# EAGLE design node (EAGLE 7.3.0)
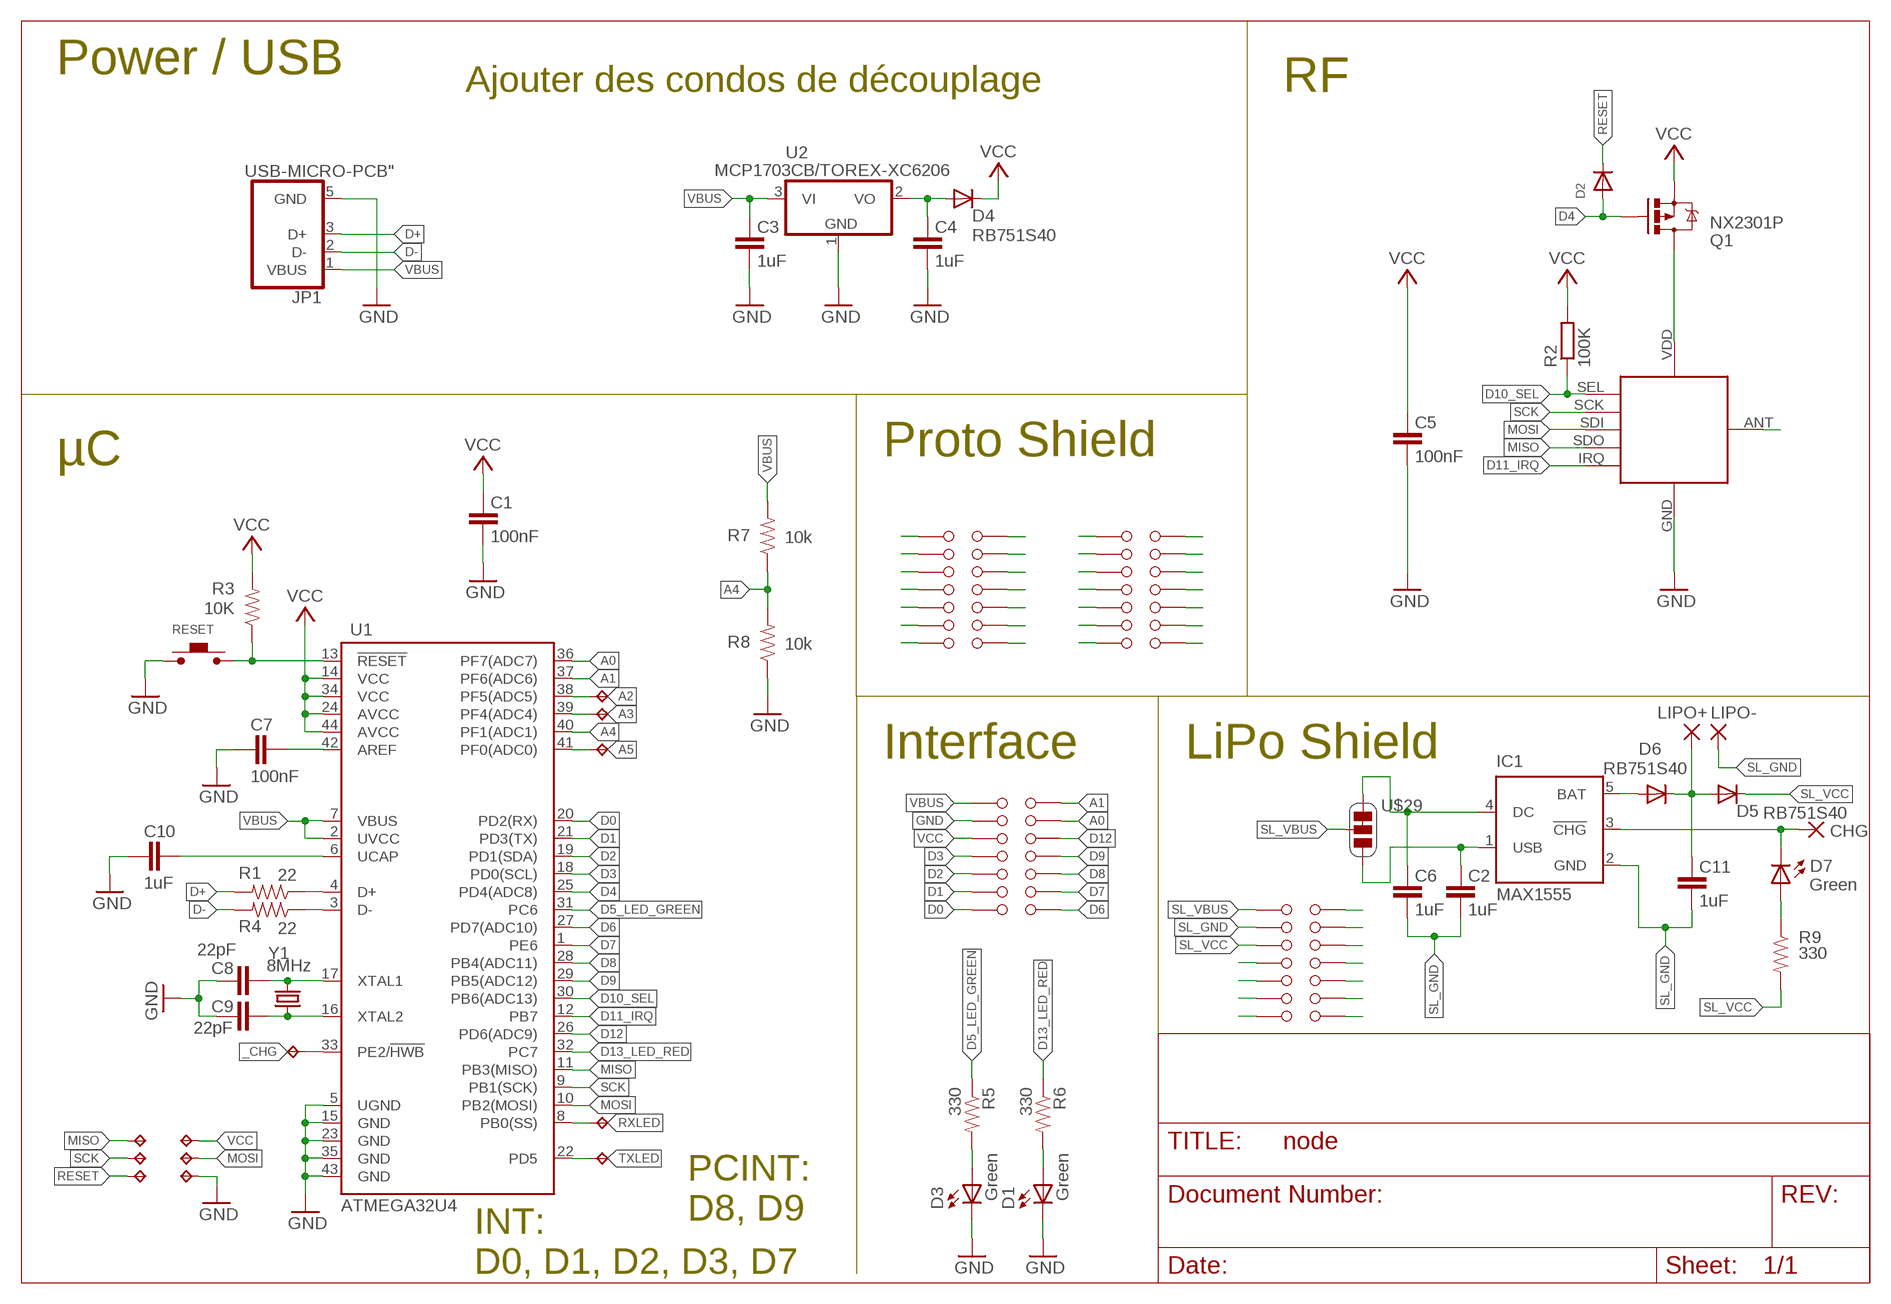
[diagram p0: schematic, sheet 1]

## Parts
C1  100nF  CAP0402-CAP  [0402-CAP]
C2  1uF  CAP0402-CAP  [0402-CAP]
C3  1uF  CAP0402-CAP  [0402-CAP]
C4  1uF  CAP0402-CAP  [0402-CAP]
C5  100nF  CAP0402-CAP  [0402-CAP]
C6  1uF  CAP0402-CAP  [0402-CAP]
C7  100nF  CAP0402-CAP  [0402-CAP]
C8  22pF  CAP0402-CAP  [0402-CAP]
C9  22pF  CAP0402-CAP  [0402-CAP]
C10  1uF  CAP0402-CAP  [0402-CAP]
C11  1uF  CAP0402-CAP  [0402-CAP]
CHG  WIREPAD1,6/0,8  [1,6/0,8]
D1  Green  LED0603  [LED-0603]
D2  DIODESOD-323F  [SOD-323F]
D3  Green  LED0603  [LED-0603]
D4  RB751S40  DIODE-SOD523  [SOD523]
D5  RB751S40  DIODE-SOD523  [SOD523]
D6  RB751S40  DIODE-SOD523  [SOD523]
D7  Green  LED0603  [LED-0603]
IC1  MAX1555  [SOT23-5L]
JP1  USB-MICRO-PCB"  [USB-MICRO-PCB]
LIPO+  WIREPAD1,6/0,8  [1,6/0,8]
LIPO-  WIREPAD1,6/0,8  [1,6/0,8]
Q1  NX2301P  MOSFET-PCHANNEL  [SOT23]
R1  22  RESISTOR0402-RES  [0402-RES]
R2  100K  R-EU_R0402  [R0402]
R3  10K  RESISTOR0402-RES  [0402-RES]
R4  22  RESISTOR0402-RES  [0402-RES]
R5  330  RESISTOR0402-RES  [0402-RES]
R6  330  RESISTOR0402-RES  [0402-RES]
R7  10k  RESISTOR0402-RES  [0402-RES]
R8  10k  RESISTOR0402-RES  [0402-RES]
R9  330  RESISTOR0402-RES  [0402-RES]
RESET  MICROSWITCH  [MICROSWITCH]
RFMXX  RFM12B_MINPADS  [RFM12B-MINPADS]
TP1  TPTP13R  [TP13R]
TP2  TPTP13R  [TP13R]
TP3  TPTP13R  [TP13R]
TP4  TPTP13R  [TP13R]
TP5  TPTP13R  [TP13R]
TP7  TPTP08R  [TP08R]
TP8  TPTP08R  [TP08R]
TP9  TPTP08R  [TP08R]
TP10  TPTP08R  [TP08R]
TP11  TPTP08R  [TP08R]
TP12  TPTP08R  [TP08R]
TP14  TPTP13R  [TP13R]
U1  ATMEGA32U4  ATMEGA32U4QFN2  [QFN-44-NOPAD]
U2  MCP1703CB/TOREX-XC6206  MCP1703CB  [SOT23]
U$1  IOPAD  [IOPAD]
U$2  IOPAD  [IOPAD]
U$3  IOPAD  [IOPAD]
U$4  IOPAD  [IOPAD]
U$5  IOPAD  [IOPAD]
U$6  IOPAD  [IOPAD]
U$7  IOPAD  [IOPAD]
U$8  IOPAD  [IOPAD]
U$9  IOPAD  [IOPAD]
U$10  IOPAD  [IOPAD]
U$11  IOPAD  [IOPAD]
U$12  IOPAD  [IOPAD]
U$13  IOPAD  [IOPAD]
U$14  IOPAD  [IOPAD]
U$15  IOPAD  [IOPAD]
U$16  IOPAD  [IOPAD]
U$17  IOPAD  [IOPAD]
U$18  IOPAD  [IOPAD]
U$19  IOPAD  [IOPAD]
U$20  IOPAD  [IOPAD]
U$21  IOPAD  [IOPAD]
U$22  IOPAD  [IOPAD]
U$23  IOPAD  [IOPAD]
U$24  IOPAD  [IOPAD]
U$25  IOPAD  [IOPAD]
U$26  IOPAD  [IOPAD]
U$27  IOPAD  [IOPAD]
U$28  IOPAD  [IOPAD]
U$29  UJUMPER-SHORT  [UJUMPER-SHORT]
U$30  IOPAD  [IOPAD]
U$31  IOPAD  [IOPAD]
U$32  IOPAD  [IOPAD]
U$33  IOPAD  [IOPAD]
U$34  IOPAD  [IOPAD]
U$35  IOPAD  [IOPAD]
U$36  IOPAD  [IOPAD]
U$37  IOPAD  [IOPAD]
U$38  IOPAD  [IOPAD]
U$39  IOPAD  [IOPAD]
U$40  IOPAD  [IOPAD]
U$41  IOPAD  [IOPAD]
U$42  IOPAD  [IOPAD]
U$43  IOPAD  [IOPAD]
U$44  IOPAD  [IOPAD]
U$45  IOPAD  [IOPAD]
U$46  IOPAD  [IOPAD]
U$47  IOPAD  [IOPAD]
U$48  IOPAD  [IOPAD]
U$49  IOPAD  [IOPAD]
U$50  IOPAD  [IOPAD]
U$51  IOPAD  [IOPAD]
U$52  IOPAD  [IOPAD]
U$53  IOPAD  [IOPAD]
U$54  IOPAD  [IOPAD]
U$55  IOPAD  [IOPAD]
U$56  IOPAD  [IOPAD]
U$57  IOPAD  [IOPAD]
Y1  8MHz  CRYSTAL5X3  [CRYSTAL-SMD-5X3]

## Nets
_CHG: TP12.TP U1.33(PE2/!HWB)
A0: U1.36(PF7(ADC7)) U$9.P$1
A1: U1.37(PF6(ADC6)) U$8.P$1
A2: TP7.TP U1.38(PF5(ADC5))
A3: TP8.TP U1.39(PF4(ADC4))
A4: R7.1 R8.2 U1.40(PF1(ADC1))
A5: TP10.TP U1.41(PF0(ADC0))
AREF: C7.2 U1.42(AREF)
D0: U1.20(PD2(RX)) U$2.P$1
D1: U1.21(PD3(TX)) U$1.P$1
D2: U1.19(PD1(SDA)) U$3.P$1
D3: U1.18(PD0(SCL)) U$4.P$1
D4: D2.A Q1.1(G) U1.25(PD4(ADC8))
D5_LED_GREEN: R5.1 U1.31(PC6)
D6: U1.27(PD7(ADC10)) U$14.P$1
D7: U1.1(PE6) U$13.P$1
D8: U1.28(PB4(ADC11)) U$12.P$1
D9: U1.29(PB5(ADC12)) U$11.P$1
D10_SEL: R2.1 RFMXX.SEL U1.30(PB6(ADC13))
D11_IRQ: RFMXX.IRQ U1.12(PB7)
D12: U1.26(PD6(ADC9)) U$10.P$1
D13_LED_RED: R6.1 U1.32(PC7)
D+: JP1.3(D+) R1.2
D-: JP1.2(D-) R4.2
GND [power]: C1.1 C3.1 C4.1 C5.1 C7.1 C8.2 C9.2 C10.1 D1.C D3.C JP1.5(GND) R8.1 RESET.P$1 RFMXX.GND TP5.TP U1.5(UGND) U1.15(GND) U1.23(GND) U1.35(GND) U1.43(GND) U2.1(GND) U$6.P$1
MISO: RFMXX.SDO(SDO/MISO) TP14.TP U1.11(PB3(MISO))
MOSI: RFMXX.SDI(SDI/MOSI) TP4.TP U1.10(PB2(MOSI))
N$1: C9.1 U1.16(XTAL2) Y1.1
N$2: R1.1 U1.4(D+)
N$3: RFMXX.ANT
N$4: C8.1 U1.17(XTAL1) Y1.3
N$5: C10.2 U1.6(UCAP)
N$6: D1.A R6.2
N$7: R4.1 U1.3(D-)
N$8: D3.A R5.2
N$9: U$15.P$1
N$10: Q1.3(D) RFMXX.VDD
N$11: D7.A R9.1
N$13: U$16.P$1
N$27: U$17.P$1
N$29: U$18.P$1
N$30: U$19.P$1
N$31: U$20.P$1
N$32: U$21.P$1
N$40: U$23.P$1
N$41: U$24.P$1
N$42: U$25.P$1
N$43: U$26.P$1
N$44: U$27.P$1
N$45: U$28.P$1
N$46: U$22.P$1
N$133: CHG.1(P) D7.C IC1.3(!CHG)
N$178: C6.2 IC1.4(DC) U$29.C0
N$179: C2.2 IC1.1(USB) U$29.C1
N$180: D6.A IC1.5(BAT)
N$181: U$33.P$1
N$182: U$34.P$1
N$183: U$35.P$1
N$184: U$36.P$1
N$185: U$38.P$1
N$186: U$39.P$1
N$187: U$40.P$1
N$188: U$41.P$1
N$189: U$42.P$1
N$190: U$43.P$1
N$191: U$37.P$1
N$192: C11.2 D5.A D6.C LIPO+.1(P)
N$245: U$44.P$1
N$246: U$45.P$1
N$247: U$46.P$1
N$248: U$47.P$1
N$249: U$48.P$1
N$250: U$49.P$1
N$251: U$50.P$1
N$252: U$52.P$1
N$253: U$53.P$1
N$254: U$54.P$1
N$255: U$55.P$1
N$256: U$56.P$1
N$257: U$57.P$1
N$258: U$51.P$1
RESET: D2.C R3.1 RESET.P$2 TP3.TP U1.13(!RESET)
RXLED: TP11.TP U1.8(PB0(SS))
SCK: RFMXX.SCK TP2.TP U1.9(PB1(SCK))
SL_GND [power]: C2.1 C6.1 C11.1 IC1.2(GND) LIPO-.1(P) U$31.P$1
SL_VBUS: U$29.COM U$30.P$1
SL_VCC: D5.C R9.2 U$32.P$1
TXLED: TP9.TP U1.22(PD5)
VBAT: C4.2 D4.A U2.2(VO)
VBUS [power]: C3.2 JP1.1(VBUS) R7.2 U1.2(UVCC) U1.7(VBUS) U2.3(VI) U$7.P$1
VCC [power]: C1.2 C5.2 D4.C Q1.2(S) R2.2 R3.2 TP1.TP U1.14(VCC) U1.24(AVCC) U1.34(VCC) U1.44(AVCC) U$5.P$1

## Notes on the sheet
- Power / USB
- Ajouter des condos de découplage | RF
- µC | Proto Shield
- Interface | LiPo Shield
- PCINT:
  D8, D9
- INT:
  D0, D1, D2, D3, D7

## Library data of the parts
C1-C11 = SparkFun:CAP: Capacitor Standard 0603 ceramic capacitor, and 0.1" leaded capacitor.
CHG LIPO+ LIPO- = wirepad:WIREPAD: Wire PAD connect wire on PCB
D1 D3 D7 = SparkFun:LED: LEDs Standard schematic elements and footprints for 5mm, 3mm, 1206, and 0603 sized LEDs. 5mm - Spark Fun Electronics SKU : COM-00529 (and others)
D2 = adafruit:DIODE: Diode SMADIODE - SMA Surface Mount Package 20V 1A Schottky Diode Digikey: 641-1014-6-ND DO-1N4148 - Through Hole Small Current Diode SOD-123 20V 1 A (.5mV Vf) Schottky Diode - Digikey: MBRX120TPMSCT-ND SOD-323 10V 570mA (.38mV Vf, 3ns) Schottky Diode - Digikey: ZLLS410CT-ND SOD-523 30V 30mA Schottky Diode (RB751S-40TE61) - Digikey: RB751S-40TE61CT-ND SOT23-R/W - SOT23 Package (R = Solder Paste/Reflow Ovens, W = Hand-Soldering) BAT54Film 40V 300mA - Digikey: 497-7162-1-ND
D4-D6 = diode:DIODE-: DIODE
IC1 = maxim:MAX1555: Dual-Input USB/AC Adapter 1-Cell Li+ Battery Chargers Source: http://www.maxim-ic.com .. MAX1551-MAX1555.pdf; MF: MAXIM; MPN: MAX1555EZK+T; OC_FARNELL: 1628222; OC_NEWARK: 59J2761
JP1 = Vitro-Eagle:USB-MICRO-PCB: USB Micro-B Plug for PCB direct connection
Q1 = SparkFun:MOSFET-PCHANNEL
R1 R3-R9 = SparkFun:RESISTOR: Resistor Basic schematic elements and footprints for 0603, 1206, and PTH resistors.
R2 = resistor:R-EU_: RESISTOR, European symbol
RESET = openalarm:MICROSWITCH
RFMXX = LowPowerLab:RFM12B_MINPADS
TP1-TP5 TP7-TP12 TP14 = testpad:TP: Test pad
U1 = SparkFun:ATMEGA32U4
U2 = linear:MCP1703: 250 mA, 16V, Low Quiescent Current LDO Regulator Source: http://ww1.microchip.com/downloads/en/DeviceDoc/22049b.pdf
U$1-U$28 U$30-U$57 = openalarm:IOPAD
U$29 = openalarm:UJUMPER-SHORT
Y1 = SparkFun:CRYSTAL: Crystals Various standard crystals. Proven footprints. Spark Fun Electronics SKU : COM-00534

## Net classes
1 power: width 0.254 mm, clearance 0.203 mm

## Board
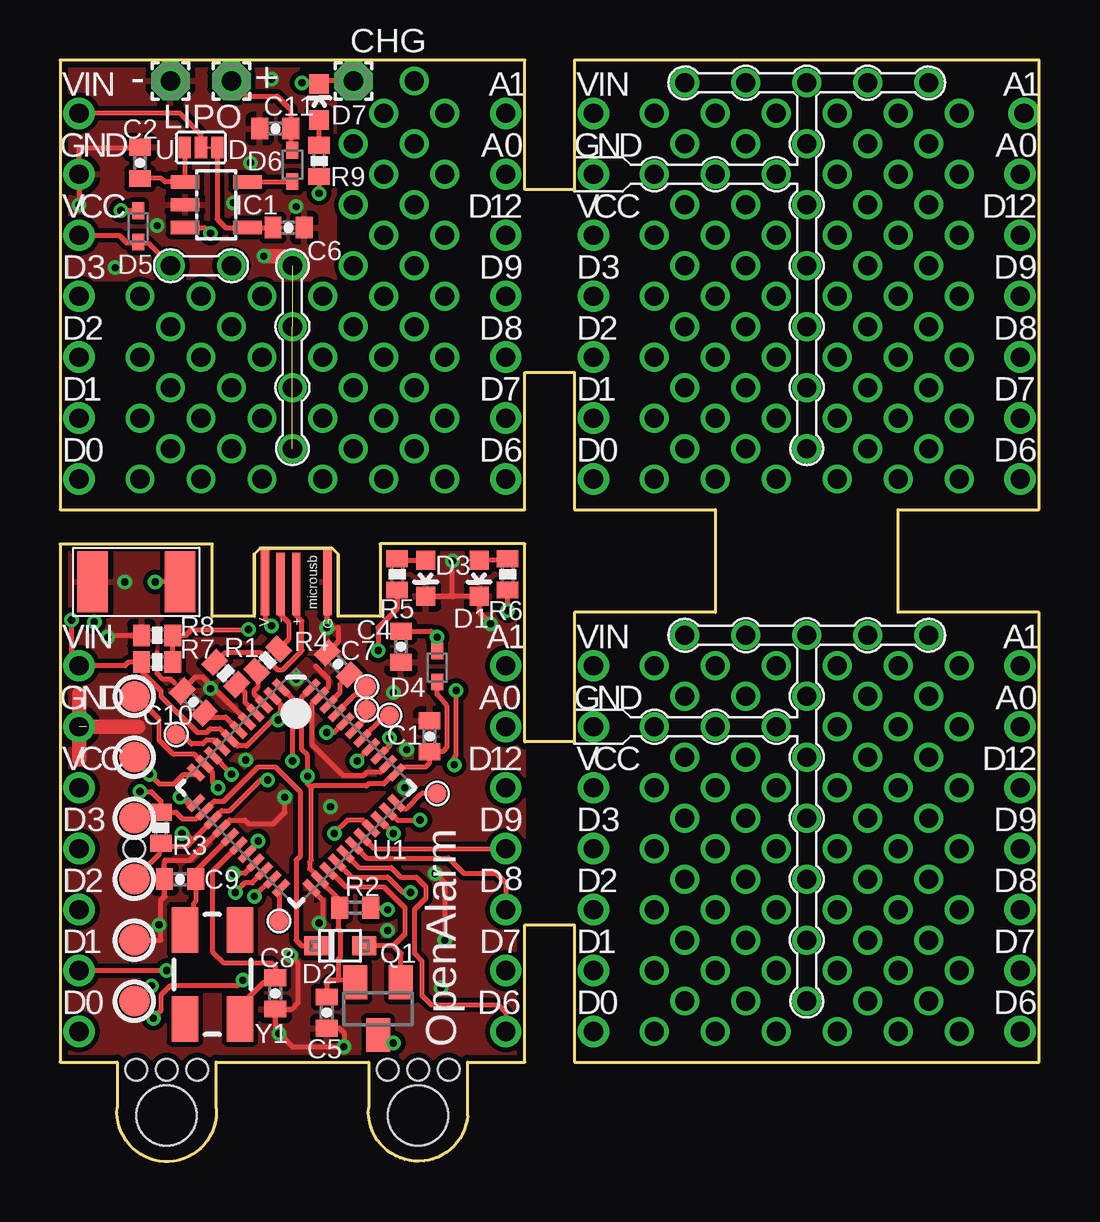
[diagram p1: board, top side]
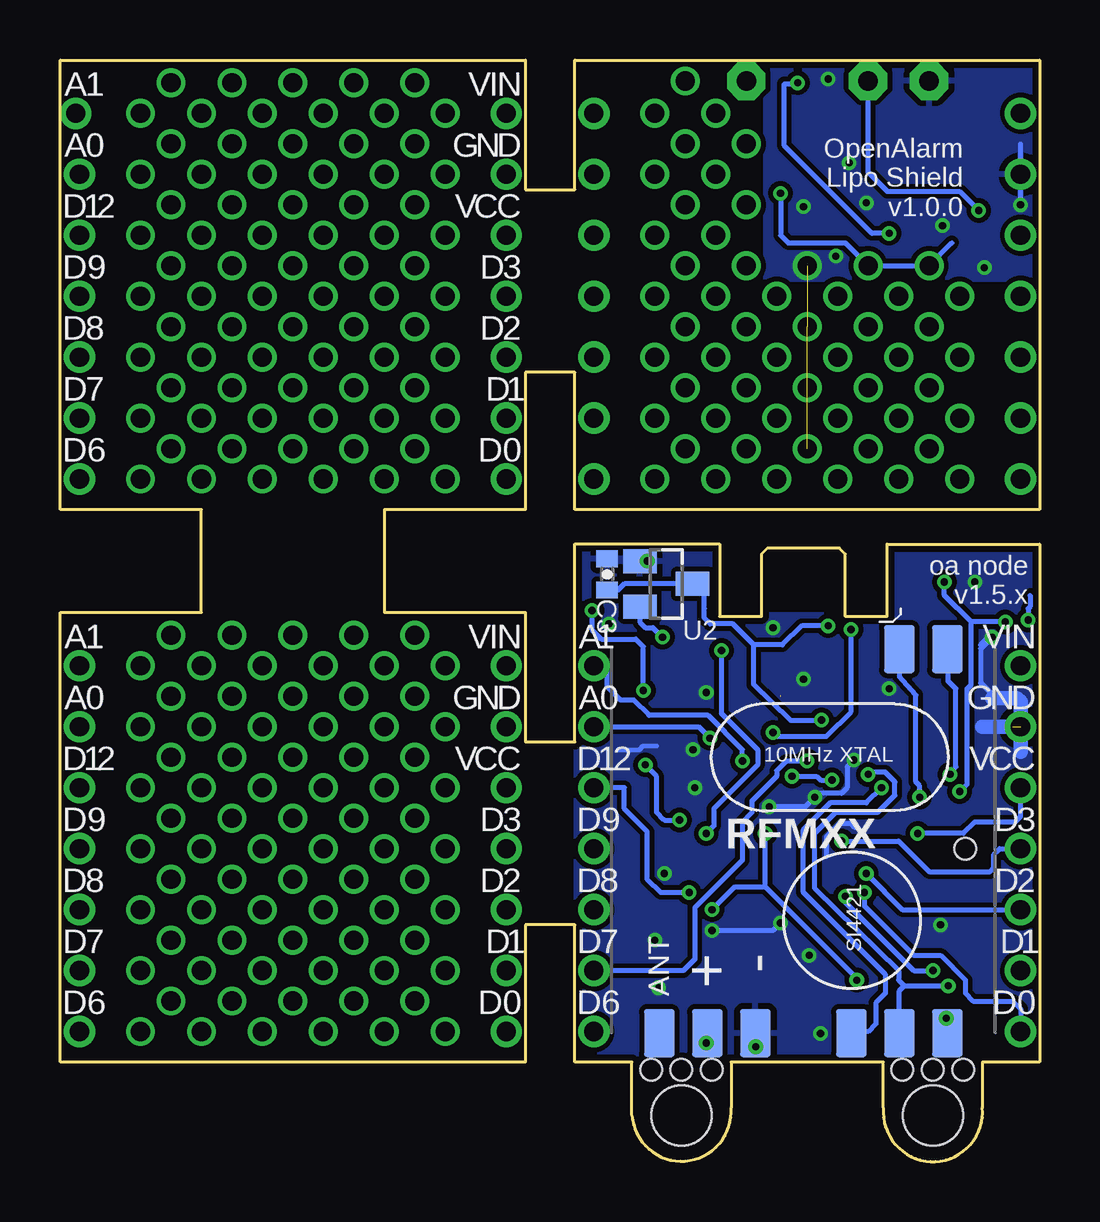
[diagram p2: board, bottom side, seen from below]

Size 40.8 x 45.9 mm. Coordinates in mm from the lower left corner, seen from the top.
Outline: 0,4.15 2.38,4.15 2.38,2.24 arc190 6.51,2.24 6.51,4.15 12.86,4.15 12.86,2.24 arc180 16.99,1.92 16.99,4.15 19.37,4.15 19.37,9.86 21.43,9.86 21.43,4.15 40.8,4.15 40.8,22.88 34.92,22.88 34.92,27.16 40.8,27.16 40.8,45.9 21.43,45.9 21.43,40.5 19.37,40.5 19.37,45.9 0,45.9 0,27.16 19.37,27.16 19.37,32.88 21.43,32.88 21.43,27.16 27.3,27.16 27.3,22.88 21.43,22.88 21.43,17.48 19.37,17.48 19.37,25.74 13.34,25.74 13.34,22.72 11.59,22.72 11.59,25.31 11.34,25.56 8.34,25.56 8.1,25.31 8.1,22.72 6.35,22.72 6.35,25.73 0,25.73 0,4.15
Copper layers (1*16): Top 0.035mm / dielectric 1.5mm / Bottom 0.035mm
Design rules "SeeedStudio_2layer_DRU_no_angle_20140221": minimum track width 6mil, minimum drill 12mil, track to track 6mil, track to pad 6mil, pad to pad 6mil, via to via 6mil, smd to smd 0mil, copper to edge 10mil, drill to drill 10mil, minimum pad ring 10mil, minimum via ring 6mil, stop-mask expansion 2mil, vias tented up to drill 100mil, thermal gap 10mil
Holes 2.5 mm at 4.45,1.92 14.92,1.92
Holes 0.9 mm at 3.17,3.83 4.45,3.83 5.71,3.83 13.65,3.83 14.92,3.83 16.19,3.83 3.1,13.04

### Footprints (pad centres in the part's own frame; a part is rotated, then mirrored left to right if it is on the bottom)
0402-CAP = smd 0.7 x 0.9: 1 -0.65,0; 2 0.65,0
1,6/0,8 = drill 0.813 pad 1.6 octagon: 1 0,0
LED-0603 = smd 0.8 x 0.8: A 0,-0.75; C 0,0.75
SOD-323F = smd 1 x 0.8: A -1,0; C 1,0
SOD523 = smd 0.7 x 0.5: A 0.7,0; C -0.6,0
SOT23-5L = smd 0.55 x 1.2: 1 -0.95,-1.3; 2 0,-1.3; 3 0.95,-1.3; 4 0.95,1.3; 5 -0.95,1.3
USB-MICRO-PCB = smd 0.35 x 2.8: 1 1.3,-1.6; 5 -1.3,-1.6 | smd 0.35 x 2.6: 2 0.65,-1.5; 3 0,-1.5
SOT23 = smd 1 x 1.4: 1 -0.95,-1.1; 2 0.95,-1.1; 3 0,1.1
0402-RES = smd 0.7 x 0.9: 1 -0.65,0; 2 0.65,0
R0402 = smd 0.7 x 0.9: 1 -0.65,0; 2 0.65,0
MICROSWITCH = smd 1.27 x 2.54: P$1 -1.826,0; P$2 1.826,0
RFM12B-MINPADS = smd 2 x 1.27: ANT 8,-6; GND 8,-2; IRQ -8,4; SCK 8,4; SDI 8,2; SDO -8,6; SEL 8,6; VDD 8,-4
TP13R = smd 1.3 x 1.3: TP 0,0
TP08R = smd 0.8 x 0.8: TP 0,0
QFN-44-NOPAD = smd 0.8 x 0.3: 1 -3.4,2.5; 2 -3.4,2; 3 -3.4,1.5; 4 -3.4,1; 5 -3.4,0.5; 6 -3.4,0; 7 -3.4,-0.5; 8 -3.4,-1; 9 -3.4,-1.5; 10 -3.4,-2; 11 -3.4,-2.5; 23 3.4,-2.5; 24 3.4,-2; 25 3.4,-1.5; 26 3.4,-1; 27 3.4,-0.5; 28 3.4,0; 29 3.4,0.5; 30 3.4,1; 31 3.4,1.5; 32 3.4,2; 33 3.4,2.5 | smd 0.3 x 0.8: 12 -2.5,-3.4; 13 -2,-3.4; 14 -1.5,-3.4; 15 -1,-3.4; 16 -0.5,-3.4; 17 0,-3.4; 18 0.5,-3.4; 19 1,-3.4; 20 1.5,-3.4; 21 2,-3.4; 22 2.5,-3.4; 34 2.5,3.4; 35 2,3.4; 36 1.5,3.4; 37 1,3.4; 38 0.5,3.4; 39 0,3.4; 40 -0.5,3.4; 41 -1,3.4; 42 -1.5,3.4; 43 -2,3.4; 44 -2.5,3.4
IOPAD = drill 0.8 pad 1.016: P$1 -0.476,0
UJUMPER-SHORT = smd 0.508 x 0.889: C0 -0.675,0; C1 0.675,0; COM 0,0
CRYSTAL-SMD-5X3 = smd 1.9 x 1.1: 1 -1.85,-1.15; 2 1.85,-1.15; 3 1.85,1.15; 4 -1.85,1.15

### Placement (x,y rotation side)
C1  15.4,17.72 270 top
C2  3.33,41.61 270 top
C3  18.02,24.47 270 bottom
C4  14.21,21.45 90 top
C5  11.11,6.21 90 top
C6  9.53,38.91 180 top
C7  11.59,20.73 315 top
C8  8.97,7 270 top
C9  5,11.77 180 top
C10  5.56,19.15 315 top
C11  8.97,43.04 0 top
CHG  12.22,45.02 0 top
D1  17.46,24.31 180 top
D2  11.67,8.99 180 top
D3  15.24,24.31 180 top
D4  15.72,20.58 90 top
D5  3.25,38.91 90 top
D6  9.68,41.53 270 top
D7  10.79,44.15 0 top
IC1  6.51,39.86 270 top
JP1  9.84,22.56 180 top
LIPO+  7.14,45.02 0 top
LIPO-  4.6,45.02 0 top
Q1  13.26,6.37 180 top
R1  6.91,20.34 135 top
R2  12.3,10.57 180 top
R3  4.21,13.91 270 top
R4  8.65,20.89 45 top
R5  14.05,24.47 90 top
R6  18.65,24.47 90 top
R7  4.05,20.81 180 top
R8  4.05,21.93 0 top
R9  10.79,41.69 270 top
RESET  3.17,24.15 0 top
RFMXX  9.84,13.35 270 bottom
TP1  3.1,11.77 0 top
TP2  3.1,6.69 0 top
TP3  3.1,14.31 0 top
TP4  3.1,19.39 0 top
TP5  3.1,9.23 0 top
TP7  13.73,18.59 0 top
TP8  12.78,18.83 0 top
TP9  9.13,10.02 0 top
TP10  12.78,19.78 0 top
TP11  4.84,17.8 0 top
TP12  15.72,15.34 0 top
TP14  3.1,16.85 0 top
U1  9.84,15.58 315 top
U2  15.56,24.07 270 bottom
U$1  1.27,7.96 0 top
U$2  1.27,5.42 0 top
U$3  1.27,10.5 0 top
U$4  1.27,13.04 0 top
U$5  1.27,15.58 0 top
U$6  1.27,18.12 0 top
U$7  1.27,20.66 0 top
U$8  18.1,20.66 180 top
U$9  18.1,18.12 180 top
U$10  18.1,15.58 180 top
U$11  18.1,13.04 180 top
U$12  18.1,10.5 180 top
U$13  18.1,7.96 180 top
U$14  18.1,5.42 180 top
U$15  22.7,20.66 0 top
U$16  22.7,18.12 0 top
U$17  22.7,15.58 0 top
U$18  22.7,13.04 0 top
U$19  22.7,10.5 0 top
U$20  22.7,7.96 0 top
U$21  22.7,5.42 0 top
U$22  39.53,5.42 180 top
U$23  39.53,7.96 180 top
U$24  39.53,10.5 180 top
U$25  39.53,13.04 180 top
U$26  39.53,15.58 180 top
U$27  39.53,18.12 180 top
U$28  39.53,20.66 180 top
U$29  5.87,42.25 180 top
U$30  1.27,43.67 0 top
U$31  1.27,41.13 0 top
U$32  1.27,38.59 0 top
U$33  18.1,43.67 180 top
U$34  1.27,33.51 0 top
U$35  1.27,36.05 0 top
U$36  18.1,41.13 180 top
U$37  18.1,33.51 180 top
U$38  1.27,30.97 0 top
U$39  18.1,38.59 180 top
U$40  18.1,30.97 180 top
U$41  1.27,28.43 0 top
U$42  18.1,36.05 180 top
U$43  18.1,28.43 180 top
U$44  22.7,41.13 0 top
U$45  39.69,43.67 180 top
U$46  39.53,41.13 180 top
U$47  22.7,38.59 0 top
U$48  39.53,38.59 180 top
U$49  39.53,36.05 180 top
U$50  22.7,36.05 0 top
U$51  39.53,33.51 180 top
U$52  39.53,30.97 180 top
U$53  22.7,33.51 0 top
U$54  22.7,43.67 0 top
U$55  39.53,28.43 180 top
U$56  22.7,28.43 0 top
U$57  22.7,30.97 0 top
Y1  6.35,7.8 270 top

### Tracks (layer width: path | path; a pad name or v marks a point on that pad's centre or on a via)
_CHG
  Top 0.203: 14.01,14.98 U1.33 14.01,14.9 14.21,14.7 14.45,14.7 15.08,15.34 TP12.TP
A0  (via drill 0.3)
  Top 0.203: 13.33,16.92 U1.36 13.31,16.98 13.39,16.98 13.73,17.32 v13.73,17.64
  Bottom 0.203: v13.73,17.64 14.21,18.12 U$9.P$1
A1  (via drill 0.3)
  Top 0.203: v12.38,16.69 12.81,17.11 U1.37
  Bottom 0.203: v12.38,16.69 12.38,17.16 13.81,18.59 16.27,18.59 16.91,19.23 17.46,19.23 18.02,19.78 18.02,20.66 U$8.P$1
A2
  Top 0.203: TP7.TP 13.41,18.43 U1.38
A3
  Top 0.203: TP8.TP 12.86,18.59 U1.39
A4  (via drill 0.3)
  Top 0.203: U1.40 11.44,17.88 v11.11,17.88 | R8.2 R7.1 4.7,21.91 4.68,21.93 5.24,21.93 5.48,22.16 v7.86,22.16
  Bottom 0.203: v11.11,17.88 10.95,17.72 8.89,17.72 7.86,18.75 v7.86,22.16
A5
  Top 0.203: U1.41 11.54,18.7 12.3,19.46 12.46,19.46 TP10.TP
AREF
  Top 0.203: 11.19,19.06 U1.42 11.24,19.04 11.24,19.12 11.67,19.54 11.67,19.9 C7.2
D0  (via drill 0.3)
  Top 0.203: U1.20 8.44,12.11 8.44,12.03 8.02,11.61 7.7,11.61 v7.3,11.21
  Bottom 0.203: v7.3,11.21 7.3,10.65 5.24,8.59 4.13,8.59 3.1,7.56 3.1,7 2.78,6.69 1.11,6.69 0.79,6.37 U$2.P$1
D1  (via drill 0.3)
  Top 0.203: U1.21 8.85,11.73 8.77,11.73 v8.1,11.05 | v4.45,7.96 U$1.P$1
  Bottom 0.203: v8.1,11.05 8.1,10.81 5.24,7.96 v4.45,7.96
D2  (via drill 0.3 pad 0.61)
  Top 0.203: U1.19 8.14,12.45 7.7,12 v7.22,12
  Bottom 0.203: v7.22,12 5.71,10.5 U$3.P$1
D3  (via drill 0.3)
  Top 0.203: U1.18 8.26,13.28 v8.26,13.35
  Bottom 0.203: v8.26,13.35 5.87,13.35 4.6,12.08 2.06,12.08 1.91,12.24 1.91,12.8 1.67,13.04 U$4.P$1
D4
  Top 0.203: U1.25 11.24,12.11 11.91,11.45 13.49,11.45 14.37,10.57 14.37,9.46 13.89,8.99 | Q1.1 14.21,7.62 14.21,8.67 13.89,8.99 | 13.89,8.99 D2.A 12.91,8.91
D5_LED_GREEN  (via drill 0.3 pad 0.61)
  Top 0.203: v13.89,13.67 13.39,14.17 13.37,14.17 U1.31 | R5.1 14.05,23.04 13.26,22.24 v13.26,21.29
  Bottom 0.203: v13.26,21.29 13.26,18.67 11.75,17.16 11.75,16.53 13.57,14.7 13.57,13.99 v13.89,13.67
D6
  Top 0.203: U1.27 12.46,12.24 13.81,12.24 14.21,11.84 14.84,11.84 15.24,11.45 15.24,10.97 14.76,10.5 14.76,8.67 15.08,8.35 15.08,6.92 15.48,6.53 18.26,6.53 18.57,6.21 U$14.P$1
D7  (via drill 0.3)
  Top 0.203: 9.13,19.86 9.25,19.75 U1.1 9.24,19.75 9.68,19.31 v9.68,16.69
  Bottom 0.203: v9.68,16.69 10.56,16.69 10.95,16.29 10.95,16.05 11.99,15.02 11.99,14.54 12.38,14.15 12.38,12.56 14.37,10.57 14.37,8.43 14.84,7.96 U$13.P$1
D8
  Top 0.203: U1.28 12.78,12.64 16.19,12.64 16.83,12 18.18,12 18.57,11.61 U$12.P$1
D9
  Top 0.203: U1.29 13.01,13.11 13.1,13.04 U$11.P$1
D10_SEL  (via drill 0.3 pad 0.61)
  Top 0.203: U1.30 12.95,13.89 12.62,14.23 11.99,14.23 v11.43,13.67 | v7.62,7.56 7.38,7.32 4.6,7.32 4.21,6.92 4.21,6.29 v3.89,5.97 | R2.1 13.57,10.57 v13.65,10.5
  Bottom 0.203: RFMXX.SEL 3.91,5.35 v3.89,5.97 | 11.43,11.45 7.62,7.64 v7.62,7.56 | 11.43,11.45 12.7,11.45 v13.65,10.5 | 11.43,11.45 v11.43,13.67
D11_IRQ  (via drill 0.3)
  Top 0.203: U1.12 5.63,14.94 5.56,14.86 | 5.48,14.78 5.56,14.78 5.56,14.86 | 5.56,14.86 5.48,14.78 | 5.48,14.78 5.08,15.18 v5,15.18
  Bottom 0.203: RFMXX.IRQ 5.84,20.21 5.16,19.45 5.16,15.81 5,15.65 v5,15.18
D12  (via drill 0.3)
  Top 0.203: U1.26 12.16,11.84 13.65,11.84 14.29,11.21 v14.61,11.21
  Bottom 0.203: v14.61,11.21 15.8,11.21 16.35,11.77 16.35,13.75 17.3,14.7 17.3,15.58 U$10.P$1
D13_LED_RED  (via drill 0.3, 0.3 pad 0.61)
  Top 0.203: U1.32 13.69,14.59 14.05,14.23 v15,14.23 | v18.65,22.96 R6.1 | v16.43,16.53 16.43,16.85 16.51,16.92 v16.51,19.62
  Bottom 0.203: v15,14.23 15.64,14.23 15.95,14.54 15.95,16.05 v16.43,16.53 | v18.65,22.96 18.65,22.16 18.26,21.77 16.83,21.77 16.51,21.45 v16.51,19.62
D+
  Top 0.203: R1.2 6.33,20.56 6.33,20.64 6.91,21.21 8.33,21.21 9.05,20.5 9.29,20.5 10.08,21.29 10.08,22.52 9.84,22.76 JP1.3
D-
  Top 0.203: 9.21,24.05 JP1.2 9.19,22.77 9.53,22.44 9.53,21.77 R4.2
GND  (via drill 0.3 pad 0.61)  (2 unrouted)
  Top 0.152: 10.79,19.39 10.64,19.23
  Top 0.203: U1.43 10.8,19.39 | 10.48,11.45 U1.23 10.48,11.37 10.95,10.89 10.95,10.1 v10.79,9.94 | U1.5 6.35,19.78 | JP1.5 11.14,22.61 v11.11,22.24 11.59,22.24 11.59,21.65 11.1,21.15 C7.1 | 10.64,19.23 10.52,19.11 10.52,17.36 11.79,16.09 12.66,16.09 12.78,16.21 13.34,16.21 U1.35 13.66,16.54 13.58,16.54 | 10.87,19.46 11.19,19.78 11.19,20.1 10.64,20.66 | 6.35,19.78 5.95,20.18 5.64,20.18 5.08,19.62 | v6.27,19.7 6.35,19.78 | v1.98,21.85 2.06,21.93 R8.1 | v17.94,22.4 17.46,22.88 D1.C D3.C 16.39,23.56 16.35,23.51 v16.35,25.02 | C5.1 11.64,5.56 RFMXX.GND 11.84,4.8 v11.83,4.78 9.68,4.78 v9.13,5.34 8.97,5.49 C8.2 9.67,6.35 9.92,6.61 9.92,8.27 v9.6,8.59 | v15.64,12 16.03,11.61 v16.03,9.23 | TP5.TP 4.21,9.23 4.21,10.89 4.37,11.05 4.37,11.75 C9.2 4.35,12.23 4.37,12.56 5.41,12.56 U1.15 6.73,13.89 7.06,14.23 7.7,14.23 7.86,14.07 8.89,14.07 9.37,14.54 v9.37,15.18 | 4.76,19.94 4.6,20.1 4.29,20.1 4.05,20.34 4.05,21.21
  Top 0.61: U$6.P$1 0.79,16.77 | 0.79,19.46 U$6.P$1 | U$6.P$1 3.25,18.12
  Bottom 0.203: 11.84,4.88 v11.83,4.78 | 8.89,12.72 8.89,13.51 8.33,14.07 7.86,14.07 7.7,13.91 | v11.27,14.78 9.76,14.78 v9.37,15.18 9.21,15.34 8.26,15.34 8.02,15.58 8.02,16.45 v7.74,16.73 | v10.79,9.94 11.11,9.62 v13.65,9.62 | 17.54,17.16 16.67,17.16 16.51,17.32 15.95,17.32 | 2.46,21.53 2.14,21.85 v1.98,21.85 2.46,21.37 2.46,19.94 1.98,19.46 1.98,19.31
  Bottom 0.61: 1.98,19.31 0.95,19.31 0.79,19.15 U$6.P$1 0.79,17.08 | 1.11,18.12 2.38,18.12
  other vias: 13.89,19.54 14.37,15.58 15.88,7.24 2.7,24.15 9.84,20.1 14.45,17.16 4.13,9.86
  pour Top: 6.35,25.74 0,25.74 0,4.15 19.35,4.15 19.35,25.74 13.34,25.74 13.34,22.72 11.43,22.72 11.43,25.58 8.26,25.58 8.26,22.72 6.35,22.72
  pour Bottom: 0,4.15 19.35,4.15 19.35,25.74 13.34,25.74 13.34,22.72 11.43,22.72 11.43,25.58 8.26,25.58 8.26,22.72 6.35,22.72 6.35,25.74 0,25.74
MISO  (via drill 0.3 pad 0.61)
  Top 0.203: U1.11 5.67,16.25 5.71,16.21 | U1.11 | U1.11 5.59,16.13 5.16,16.13 4.76,15.73 4.13,15.73 v3.73,16.13 3.1,16.77 TP14.TP
  Bottom 0.203: v3.73,16.13 3.49,16.45 3.49,19.7 3.81,20.02 3.81,21.32 RFMXX.SDO
MOSI  (via drill 0.3 pad 0.61)
  Top 0.203: v6.59,15.58 6.35,15.81 6.35,16.21 6.02,16.54 U1.10 6,16.57 5.6,16.96 4.72,16.96 4.13,17.56 4.13,18.43 3.41,19.15 3.33,19.15 TP4.TP
  Bottom 0.203: RFMXX.SDI 7.78,5.42 7.14,5.42 6.83,5.73 6.83,6.61 6.43,7 6.43,7.8 9.84,11.21 9.84,13.83 8.73,14.94 7.22,14.94 v6.59,15.58
  Bottom 0.305: RFMXX.SDI 7.62,5.35
N$1
  Top 0.203: U1.16 7.08,13.45 7,13.45 5.64,12.08 5.64,11.46 C9.1 5.65,10.83 5.56,10.73 5.56,9.69 Y1.1 5.57,9.86
N$2
  Top 0.203: U1.4 | U1.4 8.14,18.7 | R1.1 7.7,19.54 7.7,19.13 U1.4
N$4
  Top 0.203: U1.17 6.35,12.08 6.35,8.75 6.83,8.27 8.81,8.27 8.97,8.11 C8.1 9.11,7.48 8.49,7.48 7.82,6.8 Y1.3
N$5
  Top 0.203: U1.6 6.91,18.51 6.19,18.51 C10.2
N$6
  Top 0.203: R6.2 18.12,25.06 D1.A
N$7
  Top 0.203: 8.44,19.04 U1.3 8.26,19.28 8.26,19.31 8.1,19.46 8.1,19.62 8.26,19.78 8.26,20.37 R4.1
N$8
  Top 0.203: R5.2 14.11,25.06 D3.A
N$10  (via drill 0.3 pad 0.61)
  Top 0.203: v13.89,4.94 13.97,4.94 13.32,4.95 Q1.3
  Bottom 0.203: v13.89,4.94 14.26,4.94 RFMXX.VDD
N$11
  Top 0.203: R9.1 D7.A
N$12  (via drill 0.8)
  other vias: 16.03,38.59
N$14  (via drill 0.8)
  other vias: 16.03,41.13
N$15  (via drill 0.8)
  other vias: 3.33,36.05
N$16  (via drill 0.8)
  other vias: 3.33,33.51
N$17  (via drill 0.8)
  other vias: 16.03,33.51
N$18  (via drill 0.8)
  other vias: 16.03,36.05
N$19  (via drill 0.8)
  other vias: 16.03,43.67
N$20  (via drill 0.8)
  other vias: 14.76,39.86
N$21  (via drill 0.8)
  other vias: 12.22,39.86
N$22  (via drill 0.8)
  other vias: 14.76,29.7
N$23  (via drill 0.8)
  other vias: 3.33,30.97
N$24  (via drill 0.8)
  other vias: 5.87,28.43
N$25  (via drill 0.8)
  other vias: 3.33,28.43
N$26  (via drill 0.8)
  other vias: 4.6,29.7
N$28  (via drill 0.8)
  other vias: 26.04,21.93
N$33  (via drill 0.8)
  other vias: 14.76,42.4
N$34  (via drill 0.8)
  other vias: 12.22,42.4
N$35  (via drill 0.8)
  other vias: 13.49,38.59
N$36  (via drill 0.8)
  other vias: 5.87,36.05
N$37  (via drill 0.8)
  other vias: 5.87,33.51
N$38  (via drill 0.8)
  other vias: 13.49,41.13
N$39  (via drill 0.8)
  other vias: 13.49,43.67
N$47  (via drill 0.8)
  other vias: 14.76,45.02
N$49  (via drill 0.8)
  other vias: 5.87,30.97
N$50  (via drill 0.8)
  other vias: 24.77,43.67
N$51  (via drill 0.8)
  other vias: 24.77,41.13
N$52  (via drill 0.8)
  other vias: 4.6,34.78
N$53  (via drill 0.8)
  other vias: 7.14,34.78
N$54  (via drill 0.8)
  other vias: 31.11,6.69
N$55  (via drill 0.8)
  other vias: 24.77,20.66
N$56  (via drill 0.8)
  other vias: 24.77,18.12
N$57  (via drill 0.8)
  other vias: 24.77,15.58
N$58  (via drill 0.8)
  other vias: 24.77,13.04
N$59  (via drill 0.8)
  other vias: 24.77,10.5
N$60  (via drill 0.8)
  other vias: 37.47,10.5
N$61  (via drill 0.8)
  other vias: 37.47,13.04
N$62  (via drill 0.8)
  other vias: 37.47,15.58
N$63  (via drill 0.8)
  other vias: 37.47,18.12
N$64  (via drill 0.8)
  other vias: 37.47,20.66
N$65  (via drill 0.8)
  other vias: 36.2,6.69
N$66  (via drill 0.8)
  other vias: 24.77,7.96
N$67  (via drill 0.8)
  other vias: 27.3,5.42
N$68  (via drill 0.8)
  other vias: 24.77,5.42
N$69  (via drill 0.8)
  other vias: 26.04,6.69
N$70  (via drill 0.8)
  other vias: 27.3,20.66
N$71  (via drill 0.8)
  other vias: 27.3,18.12
N$72  (via drill 0.8)
  other vias: 27.3,15.58
N$73  (via drill 0.8)
  other vias: 27.3,13.04
N$74  (via drill 0.8)
  other vias: 27.3,10.5
N$75  (via drill 0.8)
  other vias: 26.04,19.39
N$76  (via drill 0.8)
  other vias: 28.57,19.39
N$77  (via drill 0.8)
  other vias: 26.04,16.85
N$78  (via drill 0.8)
  other vias: 28.57,16.85
N$79  (via drill 0.8)
  other vias: 27.3,7.96
N$80  (via drill 0.8)
  other vias: 26.04,14.31
N$81  (via drill 0.8)
  other vias: 28.57,14.31
N$82  (via drill 0.8)
  other vias: 26.04,11.77
N$83  (via drill 0.8)
  other vias: 28.57,11.77
N$84  (via drill 0.8)
  other vias: 26.04,9.23
N$85  (via drill 0.8)
  other vias: 28.57,9.23
N$86  (via drill 0.8)
  other vias: 33.66,6.69
N$87  (via drill 0.8)
  other vias: 34.92,20.66
N$88  (via drill 0.8)
  other vias: 34.92,18.12
N$89  (via drill 0.8)
  other vias: 34.92,15.58
N$90  (via drill 0.8)
  other vias: 34.92,13.04
N$91  (via drill 0.8)
  other vias: 34.92,10.5
N$92  (via drill 0.8)
  other vias: 34.92,7.96
N$93  (via drill 0.8)
  other vias: 37.47,7.96
N$94  (via drill 0.8)
  other vias: 36.2,9.23
N$95  (via drill 0.8)
  other vias: 33.66,9.23
N$96  (via drill 0.8)
  other vias: 33.66,11.77
N$97  (via drill 0.8)
  other vias: 36.2,11.77
N$98  (via drill 0.8)
  other vias: 36.2,14.31
N$99  (via drill 0.8)
  other vias: 33.66,14.31
N$100  (via drill 0.8)
  other vias: 33.66,16.85
N$101  (via drill 0.8)
  other vias: 36.2,16.85
N$102  (via drill 0.8)
  other vias: 36.2,19.39
N$103  (via drill 0.8)
  other vias: 33.66,19.39
N$104  (via drill 0.8)
  other vias: 34.92,5.42
N$105  (via drill 0.8)
  other vias: 37.47,5.42
N$106  (via drill 0.8)
  other vias: 28.57,6.69
N$107  (via drill 0.8)
  other vias: 29.84,20.66
N$108  (via drill 0.8)
  other vias: 29.84,18.12
N$109  (via drill 0.8)
  other vias: 29.84,15.58
N$110  (via drill 0.8)
  other vias: 29.84,13.04
N$111  (via drill 0.8)
  other vias: 29.84,10.5
N$112  (via drill 0.8)
  other vias: 29.84,7.96
N$113  (via drill 0.8)
  other vias: 32.38,7.96
N$114  (via drill 0.8)
  other vias: 32.38,10.5
N$115  (via drill 0.8)
  other vias: 32.38,13.04
N$116  (via drill 0.8)
  other vias: 32.38,15.58
N$117  (via drill 0.8)
  other vias: 32.38,18.12
N$118  (via drill 0.8)
  other vias: 32.38,20.66
N$119  (via drill 0.8)
  other vias: 28.57,21.93
N$120  (via drill 0.8)
  other vias: 31.11,21.93
N$121  (via drill 0.8)
  other vias: 31.11,19.39
N$122  (via drill 0.8)
  other vias: 31.11,16.85
N$123  (via drill 0.8)
  other vias: 31.11,14.31
N$124  (via drill 0.8)
  other vias: 31.11,11.77
N$125  (via drill 0.8)
  other vias: 31.11,9.23
N$126  (via drill 0.8)
  other vias: 33.66,21.93
N$127  (via drill 0.8)
  other vias: 36.2,21.93
N$128  (via drill 0.8)
  other vias: 29.84,5.42
N$129  (via drill 0.8)
  other vias: 32.38,5.42
N$130  (via drill 0.8)
  other vias: 4.6,32.24
N$131  (via drill 0.8)
  other vias: 7.14,32.24
N$132  (via drill 0.8)
  other vias: 12.22,29.7
N$133  (via drill 0.3)
  Top 0.203: IC1.3 6.03,38.91 v6.27,38.67 | v10.08,44.94 10.59,44.94 D7.C 10.79,45.02 CHG.1
  Bottom 0.203: v6.27,38.67 6.99,38.67 10.64,42.32 10.64,44.9 9.89,44.9 v10.08,44.94
N$134  (via drill 0.8)
  other vias: 24.77,38.59
N$135  (via drill 0.8)
  other vias: 24.77,36.05
N$136  (via drill 0.8)
  other vias: 13.49,36.05
N$137  (via drill 0.8)
  other vias: 13.49,33.51
N$138  (via drill 0.8)
  other vias: 13.49,30.97
N$139  (via drill 0.8)
  other vias: 16.03,30.97
N$140  (via drill 0.8)
  other vias: 14.76,32.24
N$141  (via drill 0.8)
  other vias: 12.22,32.24
N$142  (via drill 0.8)
  other vias: 12.22,34.78
N$143  (via drill 0.8)
  other vias: 14.76,34.78
N$144  (via drill 0.8)
  other vias: 14.76,37.32
N$145  (via drill 0.8)
  other vias: 12.22,37.32
N$146  (via drill 0.8)
  other vias: 24.77,33.51
N$147  (via drill 0.8)
  other vias: 37.47,33.51
N$148  (via drill 0.8)
  other vias: 37.47,36.05
N$149  (via drill 0.8)
  other vias: 37.47,38.59
N$150  (via drill 0.8)
  other vias: 13.49,28.43
N$151  (via drill 0.8)
  other vias: 16.03,28.43
N$152  (via drill 0.8)
  other vias: 7.14,29.7
N$153  (via drill 0.8)
  other vias: 37.47,41.13
N$154  (via drill 0.8)
  other vias: 37.47,43.67
N$155  (via drill 0.8)
  other vias: 36.2,29.7
N$156  (via drill 0.8)
  other vias: 8.41,36.05
N$157  (via drill 0.8)
  other vias: 8.41,33.51
N$158  (via drill 0.8)
  other vias: 8.41,30.97
N$159  (via drill 0.8)
  other vias: 10.95,30.97
N$160  (via drill 0.8)
  other vias: 10.95,33.51
N$161  (via drill 0.8)
  other vias: 10.95,36.05
N$162  (via drill 0.8)
  other vias: 24.77,30.97
N$163  (via drill 0.8)
  other vias: 27.3,28.43
N$164  (via drill 0.8)
  other vias: 24.77,28.43
N$165  (via drill 0.8)
  other vias: 26.04,29.7
N$166  (via drill 0.8)
  other vias: 27.3,43.67
N$167  (via drill 0.8)
  other vias: 27.3,41.13
N$168  (via drill 0.8)
  other vias: 27.3,38.59
N$169  (via drill 0.8)
  other vias: 27.3,36.05
N$170  (via drill 0.8)
  other vias: 27.3,33.51
N$171  (via drill 0.8)
  other vias: 26.04,42.4
N$172  (via drill 0.8)
  other vias: 28.57,42.4
N$173  (via drill 0.8)
  other vias: 26.04,39.86
N$174  (via drill 0.8)
  other vias: 28.57,39.86
N$175  (via drill 0.8)
  other vias: 27.3,30.97
N$176  (via drill 0.8)
  other vias: 8.41,28.43
N$177  (via drill 0.8)
  other vias: 10.95,28.43
N$178
  Top 0.203: C6.2 9.19,38.91 IC1.4 6.91,38.91 6.55,39.27 U$29.C0
N$179
  Top 0.203: C2.2 3.51,40.98 4.21,40.98 4.37,40.81 IC1.1 U$29.C1
N$180
  Top 0.203: IC1.5 9.14,40.81 D6.A
N$192  (via drill 0.3)
  Top 0.203: D5.A 2.71,39.61 v2.54,39.63 | D6.C 9.62,42.2 C11.2 9.6,43.05 9.6,43.83 9.05,44.39 7.78,44.39 LIPO+.1
  Bottom 0.203: v2.54,39.63 3.33,40.42 6.35,40.42 7.14,41.21 LIPO+.1
N$193  (via drill 0.8)
  other vias: 26.04,37.32
N$194  (via drill 0.8)
  other vias: 28.57,37.32
N$195  (via drill 0.8)
  other vias: 26.04,34.78
N$196  (via drill 0.8)
  other vias: 28.57,34.78
N$197  (via drill 0.8)
  other vias: 26.04,32.24
N$198  (via drill 0.8)
  other vias: 28.57,32.24
N$199  (via drill 0.8)
  other vias: 33.66,29.7
N$200  (via drill 0.8)
  other vias: 34.92,43.67
N$201  (via drill 0.8)
  other vias: 34.92,41.13
N$202  (via drill 0.8)
  other vias: 34.92,38.59
N$203  (via drill 0.8)
  other vias: 34.92,36.05
N$204  (via drill 0.8)
  other vias: 34.92,33.51
N$205  (via drill 0.8)
  other vias: 34.92,30.97
N$206  (via drill 0.8)
  other vias: 37.47,30.97
N$207  (via drill 0.8)
  other vias: 36.2,32.24
N$208  (via drill 0.8)
  other vias: 33.66,32.24
N$209  (via drill 0.8)
  other vias: 33.66,34.78
N$210  (via drill 0.8)
  other vias: 36.2,34.78
N$211  (via drill 0.8)
  other vias: 36.2,37.32
N$212  (via drill 0.8)
  other vias: 33.66,37.32
N$213  (via drill 0.8)
  other vias: 33.66,39.86
N$214  (via drill 0.8)
  other vias: 36.2,39.86
N$215  (via drill 0.8)
  other vias: 36.2,42.4
N$216  (via drill 0.8)
  other vias: 33.66,42.4
N$217  (via drill 0.8)
  other vias: 34.92,28.43
N$218  (via drill 0.8)
  other vias: 37.47,28.43
N$219  (via drill 0.8)
  other vias: 28.57,29.7
N$220  (via drill 0.8)
  other vias: 29.84,43.67
N$221  (via drill 0.8)
  other vias: 29.84,41.13
N$222  (via drill 0.8)
  other vias: 29.84,38.59
N$223  (via drill 0.8)
  other vias: 29.84,36.05
N$224  (via drill 0.8)
  other vias: 29.84,33.51
N$225  (via drill 0.8)
  other vias: 29.84,30.97
N$226  (via drill 0.8)
  other vias: 32.38,30.97
N$227  (via drill 0.8)
  other vias: 32.38,33.51
N$228  (via drill 0.8)
  other vias: 32.38,36.05
N$229  (via drill 0.8)
  other vias: 32.38,38.59
N$230  (via drill 0.8)
  other vias: 32.38,41.13
N$231  (via drill 0.8)
  other vias: 32.38,43.67
N$232  (via drill 0.8)
  other vias: 31.11,44.94
N$233  (via drill 0.8)
  other vias: 31.11,42.4
N$234  (via drill 0.8)
  other vias: 31.11,39.86
N$235  (via drill 0.8)
  other vias: 31.11,37.32
N$236  (via drill 0.8)
  other vias: 31.11,34.78
N$237  (via drill 0.8)
  other vias: 31.11,32.24
N$238  (via drill 0.8)
  other vias: 31.11,29.7
N$239  (via drill 0.8)
  other vias: 26.04,44.94
N$240  (via drill 0.8)
  other vias: 28.57,44.94
N$241  (via drill 0.8)
  other vias: 33.66,44.94
N$242  (via drill 0.8)
  other vias: 36.2,44.94
N$243  (via drill 0.8)
  other vias: 29.84,28.43
N$244  (via drill 0.8)
  other vias: 32.38,28.43
RESET  (via drill 0.3)
  Top 0.203: D2.C 10.08,8.99 9.84,9.23 9.84,12.56 10,12.72 10,15.42 8.97,16.45 8.26,16.45 6.83,15.02 6.43,15.02 6.02,14.61 U1.13 6,14.59 5.67,14.27 5.12,14.27 4.83,14.56 R3.1 | R3.1 3.35,14.56 TP3.TP | v3.33,15.42 3.81,15.42 4.21,15.02 R3.1 | RESET.P$2 v3.97,24.15
  Bottom 0.203: 2.86,22.48 2.86,19.86 3.02,19.7 3.02,15.73 v3.33,15.42 | v1.43,22.48 2.86,22.48 | 2.86,22.48 3.97,23.59 v3.97,24.15
RXLED
  Top 0.203: U1.8 6.72,17.27 6.43,17.56 6.11,17.56 5.95,17.4 5.48,17.4 5.08,17.8 TP11.TP
SCK  (via drill 0.3, 0.3 pad 0.61)
  Top 0.203: 6.36,16.92 U1.9 6.38,16.9 v7.14,16.13 | TP2.TP 3.17,6.69 v3.81,7.32
  Bottom 0.203: 5.64,7.32 5.87,7.56 5.87,7.96 9.37,11.37 9.37,13.67 8.49,14.54 6.75,14.54 6.03,15.26 6.03,15.81 6.44,16.22 7.05,16.22 v7.14,16.13 | 5.64,7.32 v3.81,7.32 | RFMXX.SCK 5.84,7.11 5.64,7.32
SL_GND  (via drill 0.3, 0.8)  (3 unrouted)
  Top 0.203: C2.1 3.32,42.25 0.79,42.25 U$31.P$1 0.79,39.78
  Top 0.61: v8.49,37.72 9.29,37.72 v9.68,37.32
  Bottom 0.203: 0.79,39.78 0.79,42.4
  other vias: 7.22,39.94 7.94,41.61 4.05,38.99 9.68,34.78 9.68,32.24 9.68,29.7 2.3,37.24 9.84,39.78 0.79,39.86 8.81,45.1
  pour Top: 0.16,45.74 11.43,45.74 11.43,36.77 0.16,36.77
  pour Bottom: 0.16,45.74 11.43,45.74 11.43,36.77 0.16,36.77
SL_VBUS
  Top 0.203: U$29.COM 5.87,42.8 5,43.67 U$30.P$1
SL_VCC  (via drill 0.3, 0.8)
  Top 0.203: U$32.P$1 2.46,38.59 2.78,38.28 3.3,38.28 | 3.3,38.28 D5.C | R9.2 v10.79,40.34 | 3.3,38.28 3.65,38.28 v4.6,37.32
  Bottom 0.203: v10.79,40.34 10.79,38.59 10.48,38.28 8.1,38.28 v7.14,37.32 v4.6,37.32 3.65,38.28
TXLED
  Top 0.203: U1.22 9.13,11.29 TP9.TP
VBAT  (via drill 0.3)
  Top 0.203: C4.2 15.46,22.1 v15.72,21.85 D4.A
  Bottom 0.203: U2.2 16.66,22.47 16.43,22.24 16.11,22.24 v15.72,21.85
VBUS  (via drill 0.3)
  Top 0.203: 8.97,18.51 7.78,17.32 7.39,17.32 U1.7 6.67,18.04 6.27,18.04 6.11,17.88 5.71,17.88 4.21,19.39 4.21,19.62 3.41,20.42 3.41,20.8 R7.2 2.86,20.81 2.7,20.66 U$7.P$1 0.48,20.97 v0.48,22.56 | 8.97,18.51 9.21,18.75 9.21,19.04 U1.2 | JP1.1 8.54,22.61 v8.81,22.32 | v9.09,18.39 8.97,18.51
  Bottom 0.203: v9.09,18.39 10.4,18.39 11.91,19.86 11.91,21.53 | 14.45,23.98 U2.3 | U2.3 17.3,24.07 17.56,23.82 C3.2 | U2.3 13.98,24 13.97,23.04 13.97,22.64 13.73,22.4 12.78,22.4 11.91,21.53 | 0.4,23.59 0.4,23.12 0.48,23.04 v0.48,22.56 | v8.81,22.32 9.92,22.32 10.72,21.53 11.91,21.53
VCC  (via drill 0.3, 0.3 pad 0.61)
  Top 0.203: 10.48,19.78 U1.44 10.08,19.35 10.08,17.16 10.32,16.92 v10.32,16.05 10.32,15.73 10.48,15.58 | U1.24 10.83,11.73 11.59,10.97 11.59,10.48 | 11.59,10.48 R2.2 | v8.65,15.89 8.33,15.89 7.06,14.62 6.75,14.62 6.36,14.23 U1.14 5.53,13.38 | 10.48,15.58 10.48,12.56 10.4,12.48 10.4,12.19 U1.24 | U1.24 10.8,11.76 | 5.53,13.38 5.26,13.11 4.35,13.11 R3.2 4.13,13.11 | Q1.2 12.3,7.48 12.23,7.55 11.59,7.55 | 11.59,10.48 11.59,9.7 11.67,9.62 11.67,8.51 11.59,8.43 11.59,7.55 | 11.11,7.07 C5.2 11.11,7.4 11.26,7.55 11.59,7.55 | v5.08,13.67 5.24,13.67 5.53,13.38 | 10.48,15.58 10.56,15.65 12.78,15.65 12.86,15.73 13.49,15.73 13.97,16.21 U1.34 14.05,16.21 14.29,16.45 15.24,16.45 15.4,16.61 C1.2 15.41,17.08 15.95,17.08 16.11,17.24 16.11,18.99 15.72,19.46 D4.C | 4.13,13.11 4.05,13.19 | 4.13,13.11 4.13,12.8 TP1.TP
  Bottom 0.203: v10.32,16.05 9.29,16.05 9.13,15.89 v8.65,15.89 | v5.08,13.67 3.17,13.67 2.7,14.15 1.03,14.15 0.79,14.38 U$5.P$1

### Text on the board
tNames: V | I | N | - | + | A | 1 | V | I | N | A | 1 | LIPO | G | N | D | U | D | A | 0 | G | N | D | A | 0 | V | C | C | D | 1 | 2 | V | C | C | D | 1 | 2 | D | 3 | D | 9 | D | 3 | D | 9 | D | 2 | D | 8 | D | 2 | D | 8 | D | 1 | D | 7 | D | 1 | D | 7 | D | 0 | D | 6 | D | 0 | D | 6 | microusb | V | I | N | A | 1 | V | I | N | A | 1 | G | N | D | A | 0 | G | N | D | A | 0 | V | C | C | D | 1 | 2 | V | C | C | D | 1 | 2 | D | 3 | D | 9 | D | 3 | D | 9 | D | 2 | D | 8 | D | 2 | D | 8 | D | 1 | D | 7 | D | 1 | D | 7 | D | 0 | D | 6 | D | 0 | D | 6 | OpenAlarm
bNames: N | I | V | 1 | A | OpenAlarm / Lipo Shield / v1.0.0 | D | N | G | 0 | A | C | C | V | 2 | 1 | D | 3 | D | 9 | D | 2 | D | 8 | D | 1 | D | 7 | D | 0 | D | 6 | D | oa node / v1.5.x | N | I | V | 1 | A | N | I | V | 1 | A | D | N | G | 0 | A | D | N | G | 0 | A | C | C | V | 2 | 1 | D | C | C | V | 2 | 1 | D | 3 | D | 9 | D | 3 | D | 9 | D | 2 | D | 8 | D | 2 | D | 8 | D | 1 | D | 7 | D | 1 | D | 7 | D | 0 | D | 6 | D | 0 | D | 6 | D